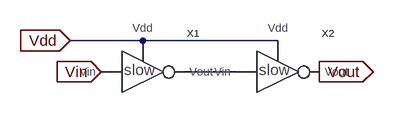
[diagram p0: schematic s_buf_slow.asc]
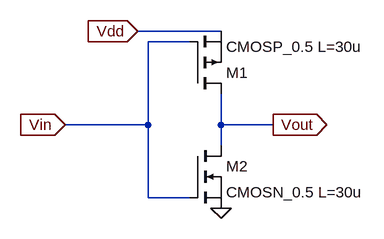
[diagram p1: sub-circuit s_inv_slow.asc]
s_buf_slow.asc, the LTspice schematic file:
Version 4
SHEET 1 880 680
WIRE 160 80 48 80
WIRE 368 80 160 80
WIRE 304 128 224 128
FLAG 48 80 Vdd
IOPIN 48 80 In
FLAG 96 128 Vin
IOPIN 96 128 In
FLAG 432 128 Vout
IOPIN 432 128 Out
SYMBOL s_inv_slow 160 128 R0
SYMATTR InstName X1
SYMBOL s_inv_slow 368 128 R0
SYMATTR InstName X2

s_inv_slow.asc, the sub-circuit schematic file:
Version 4
SHEET 1 880 680
WIRE 240 -16 112 -16
WIRE 192 0 128 0
WIRE 128 128 128 0
WIRE 128 128 0 128
WIRE 240 128 240 80
WIRE 320 128 240 128
WIRE 240 160 240 128
WIRE 128 240 128 128
WIRE 192 240 128 240
FLAG 240 256 0
FLAG 320 128 Vout
IOPIN 320 128 Out
FLAG 0 128 Vin
IOPIN 0 128 In
FLAG 112 -16 Vdd
IOPIN 112 -16 In
SYMBOL pmos 192 80 M180
SYMATTR InstName M1
SYMATTR Value CMOSP_0.5 L=30u
SYMBOL nmos 192 160 R0
SYMATTR InstName M2
SYMATTR Value CMOSN_0.5 L=30u

The netlist it stands for:
* s_buf_slow.asc
XX1 N001 Vin Vdd s_inv_slow
XX2 Vout N001 Vdd s_inv_slow

* block symbol definitions
.subckt s_inv_slow Vout Vin Vdd
M1 Vout Vin Vdd Vdd CMOSP_0.5 L=30u
M2 Vout Vin 0 0 CMOSN_0.5 L=30u
.ends s_inv_slow

.model NMOS NMOS
.model PMOS PMOS
.lib standard.mos
.backanno
.end